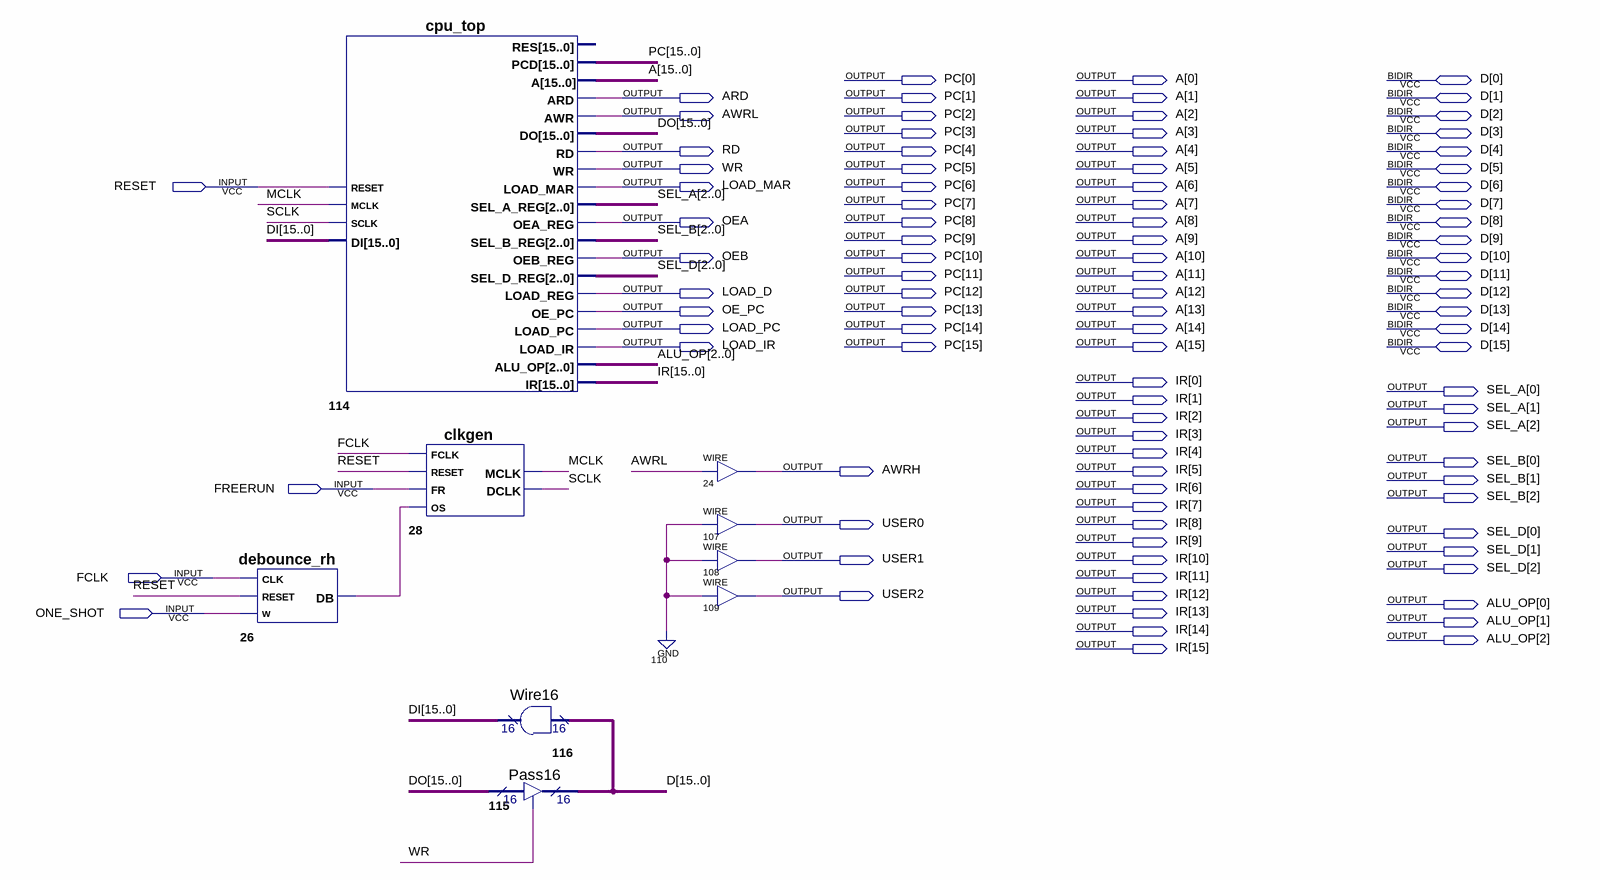
[diagram p0: schematic sheet]
// Quartus schematic cpu_top_hw.bdf as structural Verilog: 9 symbols, 95 pins
module cpu_top_hw (
  input  RESET,
  input  FREERUN,
  input  FCLK,
  input  ONE_SHOT,
  inout  [15:0] D,
  output [15:0] PC,
  output [15:0] A,
  output ARD,
  output AWRL,
  output RD,
  output WR,
  output LOAD_MAR,
  output OEA,
  output OEB,
  output LOAD_D,
  output OE_PC,
  output LOAD_PC,
  output LOAD_IR,
  output [15:0] IR,
  output [2:0] SEL_A,
  output [2:0] SEL_B,
  output AWRH,
  output USER0,
  output [2:0] SEL_D,
  output USER1,
  output USER2,
  output [2:0] ALU_OP
);

  wire MCLK, n26_db, SCLK;
  wire [15:0] DI, DO;

  debounce_rh u_26 (.CLK(FCLK), .RESET(RESET), .W(ONE_SHOT), .DB(n26_db));
  cpu_top u_114 (
    .RESET(RESET), .MCLK(MCLK), .SCLK(SCLK), .DI(DI), .PCD(PC), .A(A), .ARD(ARD), .AWR(AWRL), .DO(DO),
    .RD(RD), .WR(WR), .LOAD_MAR(LOAD_MAR), .SEL_A_REG(SEL_A), .OEA_REG(OEA), .SEL_B_REG(SEL_B),
    .OEB_REG(OEB), .SEL_D_REG(SEL_D), .LOAD_REG(LOAD_D), .OE_PC(OE_PC), .LOAD_PC(LOAD_PC), .LOAD_IR(LOAD_IR),
    .ALU_OP(ALU_OP), .IR(IR));  // open: RES
  clkgen u_28 (.FCLK(FCLK), .RESET(RESET), .FR(FREERUN), .OS(n26_db), .MCLK(MCLK), .DCLK(SCLK));
  Pass16 u_115 (.enabledt(WR), .data(DO), .tridata(D));
  Wire16 u_116 (.data0_(D), .result(DI));
  assign AWRH = AWRL;  // WIRE 24
  assign USER0 = 1'b0;  // WIRE 107
  assign USER1 = 1'b0;  // WIRE 108
  assign USER2 = 1'b0;  // WIRE 109
endmodule
